# EAGLE design ultipanel rev1.1 (EAGLE 5.11)
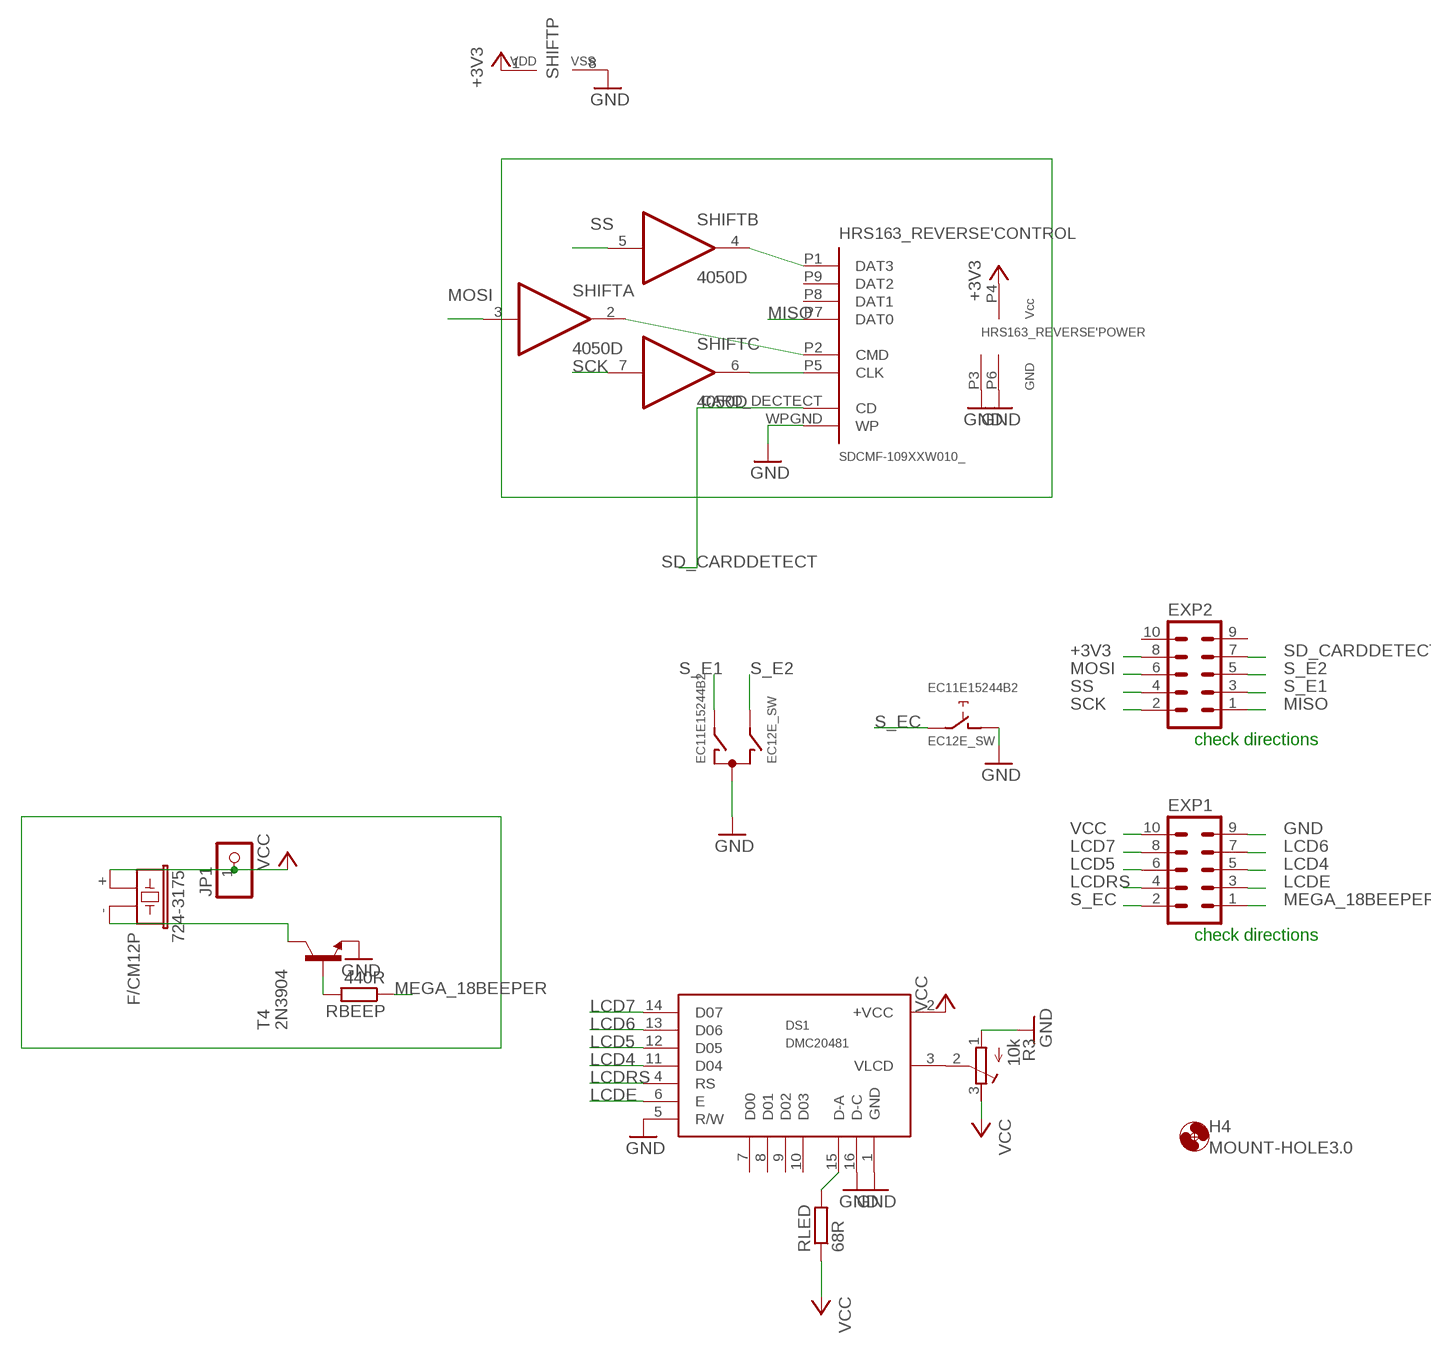
[diagram p0: schematic, sheet 1]

## Parts
724-3175  F/CM12P  [F/CM12P]
DS1  DMC20481  [DM20481_NOBOTHOLES]
EC11E15244B2  EC12E_SW  [ALPS_EC12E_SW]
EXP1  ML10L  [ML10L]
EXP2  ML10L  [ML10L]
H4  MOUNT-HOLE3.0  [3,0]
HRS163_REVERSE  SDCMF-109XXW010_  [HRS163]
JP1  PINHD-1X1  [1X01]
R3  10k  R-TRIMM5X  [RTRIM5X]
RBEEP  440R  R-EU_M0805  [M0805]
RLED  68R  R-EU_R1206  [R1206]
SHIFT  4050D  [SO16]
T4  2N3904  [TO92]

## Nets
+3V3: EXP2.8 HRS163_REVERSE.P4('POWER:VCC) SHIFT.1(P:VDD)
GND: DS1.1(GND) DS1.5(R/W) DS1.16(D-C) EC11E15244B2.C EC11E15244B2.D EXP1.9 HRS163_REVERSE.P3('POWER:GND) HRS163_REVERSE.P6('POWER:GND) HRS163_REVERSE.WPGND('CONTROL:WP) R3.1(E) SHIFT.8(P:VSS) T4.3(E)
LCD4: DS1.11(D04) EXP1.5
LCD5: DS1.12(D05) EXP1.6
LCD6: DS1.13(D06) EXP1.7
LCD7: DS1.14(D07) EXP1.8
LCDE: DS1.6(E) EXP1.3
LCDRS: DS1.4(RS) EXP1.4
MEGA_18BEEPER: EXP1.1 RBEEP.1
MISO: EXP2.1 HRS163_REVERSE.P7('CONTROL:DAT0)
MOSI: EXP2.6 SHIFT.3(A:I)
N$1: DS1.3(VLCD) R3.2(S)
N$3: DS1.15(D-A) RLED.2
N$4: RBEEP.2 T4.2(B)
N$7: 724-3175.- T4.1(C)
N$9: HRS163_REVERSE.P5('CONTROL:CLK) SHIFT.6(C:O)
N$13: HRS163_REVERSE.P2('CONTROL:CMD) SHIFT.2(A:O)
N$14: HRS163_REVERSE.P1('CONTROL:DAT3) SHIFT.4(B:O)
S_E1: EC11E15244B2.A EXP2.3
S_E2: EC11E15244B2.B EXP2.5
S_EC: EC11E15244B2.E EXP1.2
SCK: EXP2.2 SHIFT.7(C:I)
SD_CARDDETECT: EXP2.7 HRS163_REVERSE.CARD_DECTECT('CONTROL:CD)
SS: EXP2.4 SHIFT.5(B:I)
VCC: 724-3175.+ DS1.2(+VCC) EXP1.10 JP1.1 R3.3(A) RLED.1
Unconnected: DS1.7(D00) DS1.8(D01) DS1.9(D02) DS1.10(D03) EC11E15244B2.GND1(G) EC11E15244B2.GND2(G) EXP2.9 EXP2.10 HRS163_REVERSE.P8('CONTROL:DAT1) HRS163_REVERSE.P9('CONTROL:DAT2) SHIFT.9(D:I) SHIFT.10(D:O) SHIFT.11(E:I) SHIFT.12(E:O) SHIFT.14(F:I) SHIFT.15(F:O)

## Notes on the sheet
- check directions
- check directions

## Library data of the parts
724-3175 = buzzer:F/CM12P: BUZZER Source: Buerklin
DS1 = abi-lcd:DMC20481
EC11E15244B2 = switch-alps:EC12E_SW: ALPS rotary Encoder EC12E series with switch; MPN: EC12E2424407; OC_FARNELL: 1520813; OC_NEWARK: 74M1068
EXP1 EXP2 = con-harting-ml:ML10: HARTING
H4 = holes:MOUNT-HOLE: MOUNTING HOLE with drill center marker
HRS163_REVERSE = card_adapters:SDCMF-109XXW010_*: KingFont SD-CARD SDCMF-109XXW010 SD-MODE
JP1 = pinhead:PINHD-1X1: PIN HEADER
R3 = rcl:R-TRIMM: Trimm resistor
RBEEP = resistor:R-EU_: RESISTOR, European symbol
RLED = rcl:R-EU_: RESISTOR, European symbol
SHIFT = 40xx:4050: Hex non-inverting BUFFER
T4 = transistor:2N3904: NPN TRANSISTOR

## Net classes
0 default: width 0.356 mm, drill 0.051 mm, clearance 0.152 mm
1 ratsnest: width 0.025 mm, drill 0.025 mm, clearance 0.025 mm

## Board
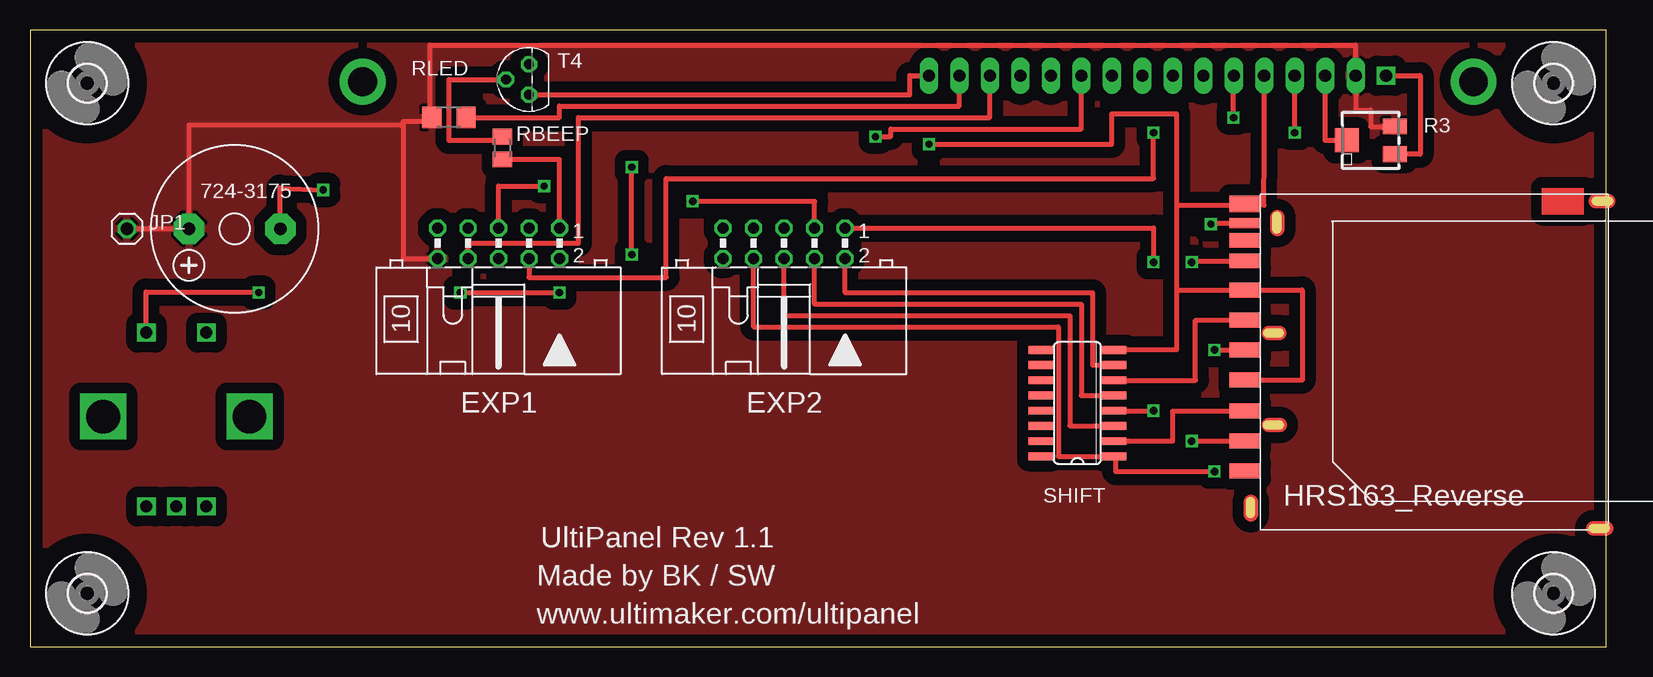
[diagram p1: board, top side]
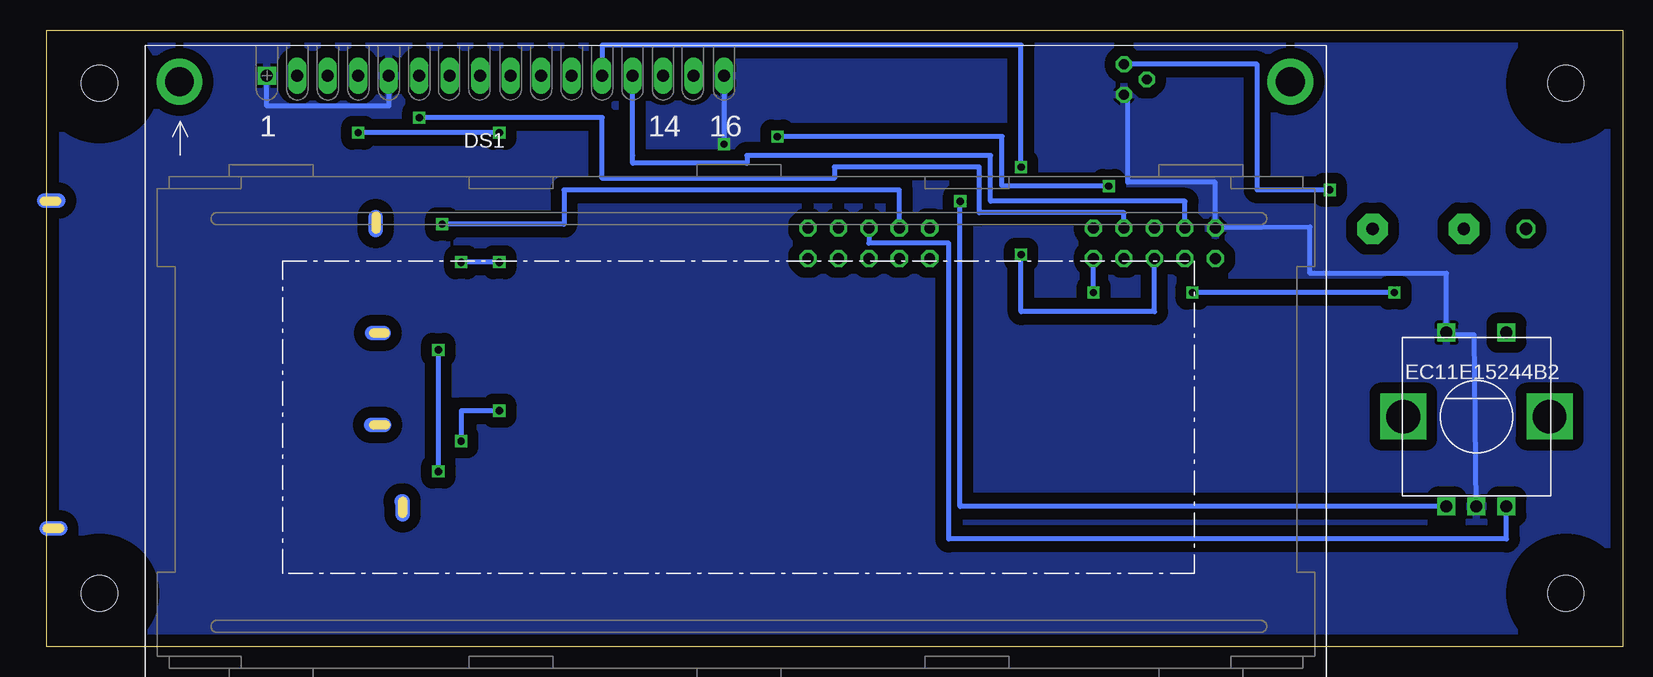
[diagram p2: board, bottom side, seen from below]

Size 131.41 x 51.44 mm. Coordinates in mm from the lower left corner, seen from the top.
Outline: 0,0 131.41,0 131.41,51.42 115.25,51.44 0,51.44 0,0
Copper layers (1*16): Top 0.035mm / dielectric 1.5mm / Bottom 0.035mm
Design rules "10mils *": minimum track width 10mil, minimum drill 24mil, track to track 10mil, track to pad 10mil, pad to pad 10mil, via to via 10mil, smd to smd 10mil, copper to edge 40mil, drill to drill 10mil, minimum pad ring 10mil, minimum via ring 8mil, stop-mask expansion 4mil, vias tented up to drill 0mil, thermal gap 10mil

### Footprints (pad centres in the part's own frame; a part is rotated, then mirrored left to right if it is on the bottom)
F/CM12P = drill 1.016 pad 2.54 octagon: + 3.81,0; - -3.81,0
DM20481_NOBOTHOLES = drill 1.016 pad 1.422 square: 1 -33.033,27.94 | drill 1.016 pad 1.422 long: 2 -30.493,27.94; 3 -27.953,27.94; 4 -25.413,27.94; 5 -22.873,27.94; 6 -20.333,27.94; 7 -17.793,27.94; 8 -15.253,27.94; 9 -12.713,27.94; 10 -10.173,27.94; 11 -7.633,27.94; 12 -5.093,27.94; 13 -2.553,27.94; 14 -0.013,27.94; 15 2.527,27.94; 16 5.067,27.94 | drill 2.4 pad 3.81 round: P$3 52.286,27.445; P$4 -40.322,27.432
ALPS_EC12E_SW = drill 1 square: A -2.5,-7.5; B 2.5,-7.5; C 0,-7.5; D -2.5,7; E 2.5,7 | drill 2.8 square: GND1 -6.1,0; GND2 6.1,0
ML10L = drill 0.914 octagon: 1 -5.08,-1.27; 2 -5.08,1.27; 3 -2.54,-1.27; 4 -2.54,1.27; 5 0,-1.27; 6 0,1.27; 7 2.54,-1.27; 8 2.54,1.27; 9 5.08,-1.27; 10 5.08,1.27
3,0 = hole 3: 0,0
HRS163 = smd 0.8 x 2.54: CARD_DECTECT 11.2,1.3 | smd 1.25 x 2.54: P1 -6.97,1.3; P2 -4.47,1.3; P3 -1.9,1.3; P4 0.625,1.3; P5 3.1,1.3; P6 5.625,1.3; P9 -9.47,1.3 | smd 1.2 x 2.54: P7 8.05,1.3; P8 9.75,1.3 | smd 1.4 x 2.54: WPGND 12.8,1.3
1X01 = drill 1.016 octagon: 1 0,0
RTRIM5X = smd 1.3 x 2: 1 -1.15,-2; 3 1.15,-2 | smd 2 x 2: 2 0,2
M0805 = smd 1.3 x 1.6: 1 -0.95,0; 2 0.95,0
R1206 = smd 1.6 x 1.803: 1 -1.422,0; 2 1.422,0
SO16 = smd 0.66 x 2.032: 1 -4.445,-3.073; 2 -3.175,-3.073; 3 -1.905,-3.073; 4 -0.635,-3.073; 5 0.635,-3.073; 6 1.905,-3.073; 7 3.175,-3.073; 8 4.445,-3.073; 9 4.445,3.073; 10 3.175,3.073; 11 1.905,3.073; 12 0.635,3.073; 13 -0.635,3.073; 14 -1.905,3.073; 15 -3.175,3.073; 16 -4.445,3.073
TO92 = drill 0.813 octagon: 1 1.27,0; 2 0,1.905; 3 -1.27,0

### Placement (x,y rotation side)
724-3175  17.06,34.85 180 top
DS1  80.01,19.68 0 bottom
EC11E15244B2  12.21,19.2 0 bottom
EXP1  39.05,33.66 180 top
EXP2  62.86,33.66 180 top
H1  MOUNT-HOLE3.0  [3,0]  127,4.45 0 top
H2  MOUNT-HOLE3.0  [3,0]  127,46.99 0 top
H3  MOUNT-HOLE3.0  [3,0]  4.76,46.99 0 top
H4  4.76,4.45 0 top
HRS163_REVERSE  102.55,24.13 90 top
JP1  8.08,34.85 0 top
R3  111.76,42.23 90 top
RBEEP  39.37,41.59 90 top
RLED  34.92,44.13 0 top
SHIFT  87.31,20.32 90 top
T4  41.59,47.31 90 top

### Tracks (layer width: path | path; a pad name or v marks a point on that pad's centre or on a via)
+3V3  (via drill 0.6)
  Top 0.406: EXP2.8 60.33,26.67 85.72,26.67 85.72,15.88 SHIFT.1 90.49,15.88 90.49,14.61 v98.74,14.61 | HRS163_REVERSE.P4 98.74,24.75 v98.74,24.77
  Bottom 0.406: v98.74,14.61 v98.74,24.77
GND  (via drill 0.6)
  Top 0.406: SHIFT.8 95.57,24.77 95.57,29.75 | 101.28,36.93 100.65,36.83 95.57,36.83 | 95.57,29.75 HRS163_REVERSE.P6 106.05,29.75 106.05,22.23 HRS163_REVERSE.P3 | 95.57,36.83 95.57,29.75 | 101.28,36.93 HRS163_REVERSE.WPGND | 101.28,36.93 102.87,36.83 102.88,41.27 DS1.5 | 113.03,47.62 DS1.1 115.89,47.62 115.89,41.08 R3.1 | T4.3 73.34,46.04 73.34,47.62 DS1.16 | v74.93,41.91 90.17,41.91 90.17,44.45 95.57,44.45 95.57,36.83
  Bottom 0.406: T4.3 41.28,46.04 41.28,38.73 33.97,38.73 EXP1.9 26.09,35 26.09,31.12 14.71,31.12 EC11E15244B2.D 14.71,26 12.41,26 EC11E15244B2.C | DS1.16 74.93,47.62 v74.93,41.91 | DS1.5 102.87,47.62 102.87,45.09 113.04,45.09 DS1.1
  pour Bottom (isolate 0.914): 0,0 131.44,0 131.44,51.44 0,51.44
LCD4  (via drill 0.6)
  Top 0.406: EXP1.5 39.05,38.42 v42.86,38.42 | v70.48,42.55 71.75,42.55 71.75,43.18 87.64,43.18 DS1.11
  Bottom 0.406: v42.86,38.42 51.75,38.42 51.75,42.55 v70.48,42.55
LCD5  (via drill 0.6)
  Top 0.406: v50.17,32.7 v50.17,40.01
  Bottom 0.406: DS1.12 85.09,47.62 85.09,50.16 50.17,50.16 v50.17,40.01 | v50.17,32.7 50.17,27.94 39.05,27.94 EXP1.6
LCD6
  Bottom 0.406: EXP1.7 36.51,37.15 52.7,37.15 52.7,40.96 73.02,40.96 73.02,40.32 82.55,40.32 82.55,40.96 82.56,40.96 DS1.13
LCD7
  Top 0.406: DS1.14 80.01,47.62 80.01,44.13 45.72,44.13 45.72,33.66 36.51,33.66 EXP1.8
LCDE  (via drill 0.6)
  Top 0.406: DS1.6 100.33,47.62 v100.33,44.13
  Bottom 0.406: EXP1.3 41.59,36.2 53.66,36.2 53.66,40.01 65.72,40.01 65.72,39.05 85.09,39.05 85.09,44.13 v100.33,44.13 v100.34,44.13
LCDRS  (via drill 0.6)
  Top 0.406: EXP1.4 41.59,30.8 53.02,30.8 53.02,39.05 93.66,39.05 v93.66,42.86 | v105.42,42.86 DS1.4
  Bottom 0.406: v93.66,42.86 v105.42,42.86
MEGA_18BEEPER
  Top 0.406: EXP1.1 44.13,40.64 RBEEP.1
MISO  (via drill 0.6)
  Top 0.406: HRS163_REVERSE.P7 96.84,32.18 v96.84,32.07 | v93.66,32.07 93.66,34.92 EXP2.1
  Bottom 0.406: v93.66,32.07 v96.84,32.07
MOSI
  Top 0.406: SHIFT.3 86.68,18.41 86.68,27.62 62.86,27.62 EXP2.6
N$1
  Top 0.406: R3.2 107.96,42.23 DS1.3
N$3
  Top 0.406: DS1.15 77.47,47.62 77.47,45.09 44.13,45.09 44.13,44.13 RLED.2
N$4
  Top 0.406: 39.69,42.54 RBEEP.2 39.37,42.23 34.92,42.23 34.92,47.31 T4.2
N$7  (via drill 0.6)
  Top 0.406: 724-3175.- 20.85,38.26 v24.45,38.1
  Bottom 0.406: T4.1 30.48,48.58 30.48,38.1 v24.45,38.1
N$9
  Top 0.406: HRS163_REVERSE.P5 97.16,27.23 97.16,22.23 SHIFT.6
N$13
  Top 0.406: HRS163_REVERSE.P2 95.25,19.66 95.25,17.14 SHIFT.2
N$14  (via drill 0.6)
  Top 0.406: HRS163_REVERSE.P1 96.84,17.16 v96.84,17.14 | SHIFT.4 v93.66,19.68
  Bottom 0.406: 96.84,19.68 v96.84,17.14 | 96.84,19.68 96.84,18.73 | v93.66,19.68 96.84,19.68
S_E1  (via drill 0.6)
  Top 0.406: EXP2.3 65.41,37.15 v55.25,37.15
  Bottom 0.406: EC11E15244B2.A 55.25,11.7 v55.25,37.15
S_E2
  Bottom 0.406: EC11E15244B2.B 9.71,8.99 56.2,8.99 56.2,33.66 62.86,33.66 EXP2.5
S_EC  (via drill 0.6)
  Top 0.406: v35.88,29.53 v44.13,29.53 | EC11E15244B2.E 9.69,26.2 9.69,29.6 19.05,29.6 v19.05,29.53
  Bottom 0.406: v44.13,29.53 EXP1.2 | v19.05,29.53 v35.88,29.53
SCK
  Top 0.406: SHIFT.7 88.58,23.5 88.58,29.53 67.94,29.53 EXP2.2
SD_CARDDETECT  (via drill 0.6)
  Top 0.406: HRS163_REVERSE.CARD_DECTECT 98.42,35.33 v98.42,35.24
  Bottom 0.406: v98.42,35.24 88.27,35.24 88.27,38.1 60.33,38.1 EXP2.7
SS
  Top 0.406: SHIFT.5 87.63,20.95 87.63,28.57 65.41,28.57 EXP2.4
VCC
  Top 0.406: EXP1.10 31.11,32.38 31.11,43.5 | 31.11,43.5 31.11,43.81 33.5,43.81 RLED.1 33.34,44.13 33.34,50.16 110.49,50.16 110.49,47.62 DS1.2 110.5,44.77 111.76,44.77 111.76,43.38 R3.3 | JP1.1 724-3175.+ 13.25,43.53 30.96,43.53 30.96,43.5 31.11,43.5
  pour Top (isolate 0.914): 0,51.44 0,0 131.44,0 131.44,51.44

### Text on the board
tNames: HRS163_Reverse | UltiPanel Rev 1.1 | Made by BK / SW | www.ultimaker.com/ultipanel